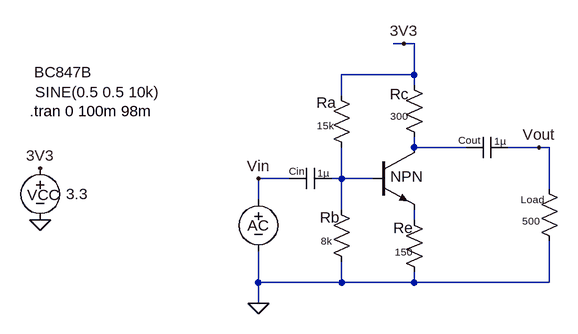
[diagram p0: schematic CLASS A Amplifier.asc]
CLASS A Amplifier.asc, the LTspice schematic file:
Version 4
SHEET 1 880 680
WIRE 208 -48 192 -48
WIRE 224 -48 208 -48
WIRE 224 0 224 -48
WIRE 224 0 112 0
WIRE 224 16 224 0
WIRE 112 32 112 0
WIRE 224 112 224 96
WIRE 304 112 224 112
WIRE 416 112 368 112
WIRE 432 112 416 112
WIRE 32 160 -16 160
WIRE 112 160 112 112
WIRE 112 160 96 160
WIRE 160 160 112 160
WIRE 432 176 432 112
WIRE -16 192 -16 160
WIRE 112 208 112 160
WIRE 224 224 224 208
WIRE -16 320 -16 272
WIRE 112 320 112 288
WIRE 112 320 -16 320
WIRE 224 320 224 304
WIRE 224 320 112 320
WIRE 432 320 432 256
WIRE 432 320 224 320
WIRE -16 352 -16 320
FLAG 208 -48 3V3
FLAG 416 112 Vout
FLAG -352 144 3V3
FLAG -352 224 0
FLAG -16 352 0
FLAG -16 160 Vin
SYMBOL npn 160 112 R0
WINDOW 0 27 45 Left 2
WINDOW 3 -521 -116 Left 2
SYMATTR InstName NPN
SYMATTR Value BC847B
SYMBOL res 208 0 R0
WINDOW 0 -22 30 Left 2
WINDOW 3 -21 64 Left 1
SYMATTR InstName Rc
SYMATTR Value 300
SYMBOL res 208 208 R0
WINDOW 0 -16 28 Left 2
WINDOW 3 -14 65 Left 1
SYMATTR InstName Re
SYMATTR Value 150
SYMBOL res 96 16 R0
WINDOW 0 -23 27 Left 2
WINDOW 3 -22 62 Left 1
SYMATTR InstName Ra
SYMATTR Value 15k
SYMBOL res 96 192 R0
WINDOW 0 -17 28 Left 2
WINDOW 3 -16 64 Left 1
SYMATTR InstName Rb
SYMATTR Value 8k
SYMBOL cap 304 128 R270
WINDOW 0 17 5 VTop 1
WINDOW 3 36 52 VBottom 1
SYMATTR InstName Cout
SYMATTR Value 1µ
SYMBOL voltage -16 176 R0
WINDOW 123 0 0 Left 0
WINDOW 39 0 0 Left 0
WINDOW 0 -17 56 Left 2
WINDOW 3 -344 -149 Left 2
SYMATTR InstName AC
SYMATTR Value SINE(0.5 0.5 10k)
SYMBOL voltage -352 128 R0
WINDOW 0 -20 57 Left 2
WINDOW 3 40 56 Left 2
WINDOW 123 0 0 Left 0
WINDOW 39 0 0 Left 0
SYMATTR InstName VCC
SYMATTR Value 3.3
SYMBOL cap 96 144 R90
WINDOW 0 15 53 VBottom 1
WINDOW 3 -3 12 VTop 1
SYMATTR InstName Cin
SYMATTR Value 1µ
SYMBOL res 416 160 R0
WINDOW 0 -28 32 Left 1
WINDOW 3 -26 65 Left 1
SYMATTR InstName Load
SYMATTR Value 500
TEXT -368 56 Left 2 !.tran 0 100m 98m

The netlist it stands for:
* CLASS A Amplifier.asc
Q§NPN N001 N002 N003 0 BC847B
Rc 3V3 N001 300
Re N003 0 150
Ra 3V3 N002 15k
Rb N002 0 8k
Cout N001 Vout 1µ
V§AC Vin 0 SINE(0.5 0.5 10k)
VCC 3V3 0 3.3
Cin N002 Vin 1µ
R§Load Vout 0 500
.model NPN NPN
.model PNP PNP
.lib standard.bjt
.tran 0 100m 98m
.backanno
.end